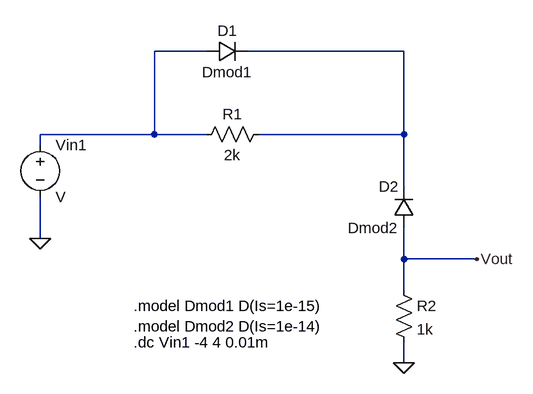
[diagram p0: schematic Draft3-1.asc]
Draft3-1.asc, the LTspice schematic file:
Version 4
SHEET 1 880 680
WIRE 224 176 144 176
WIRE 528 176 288 176
WIRE 144 304 144 176
WIRE 144 304 -32 304
WIRE 224 304 144 304
WIRE 528 304 528 176
WIRE 528 304 304 304
WIRE -32 320 -32 304
WIRE 528 384 528 304
WIRE -32 464 -32 400
WIRE 528 496 528 448
WIRE 640 496 528 496
WIRE 528 544 528 496
WIRE 528 656 528 624
FLAG -32 464 0
FLAG 528 656 0
FLAG 640 496 Vout
SYMBOL diode 224 192 R270
WINDOW 0 32 32 VTop 2
WINDOW 3 0 32 VBottom 2
SYMATTR InstName D1
SYMATTR Value Dmod1
SYMBOL diode 544 448 R180
WINDOW 0 24 64 Left 2
WINDOW 3 24 0 Left 2
SYMATTR InstName D2
SYMATTR Value Dmod2
SYMBOL res 320 288 R90
WINDOW 0 0 56 VBottom 2
WINDOW 3 32 56 VTop 2
SYMATTR InstName R1
SYMATTR Value 2k
SYMBOL res 512 528 R0
SYMATTR InstName R2
SYMATTR Value 1k
SYMBOL voltage -32 304 R0
SYMATTR InstName Vin1
TEXT 112 568 Left 2 !.model Dmod1 D(Is=1e-15)\n.model Dmod2 D(Is=1e-14)
TEXT 112 624 Left 2 !.dc Vin1 -4 4 0.01m

The netlist it stands for:
* Draft3-1.asc
D1 N001 N002 Dmod1
D2 Vout N002 Dmod2
R1 N002 N001 2k
R2 Vout 0 1k
Vin1 N001 0 V
.model D D
.lib standard.dio
.model Dmod1 D(Is=1e-15)
.model Dmod2 D(Is=1e-14)
.dc Vin1 -4 4 0.01m
.backanno
.end